# EAGLE design TokTok_Bluetooth (EAGLE 6.4)

## Sheet 1 of 2
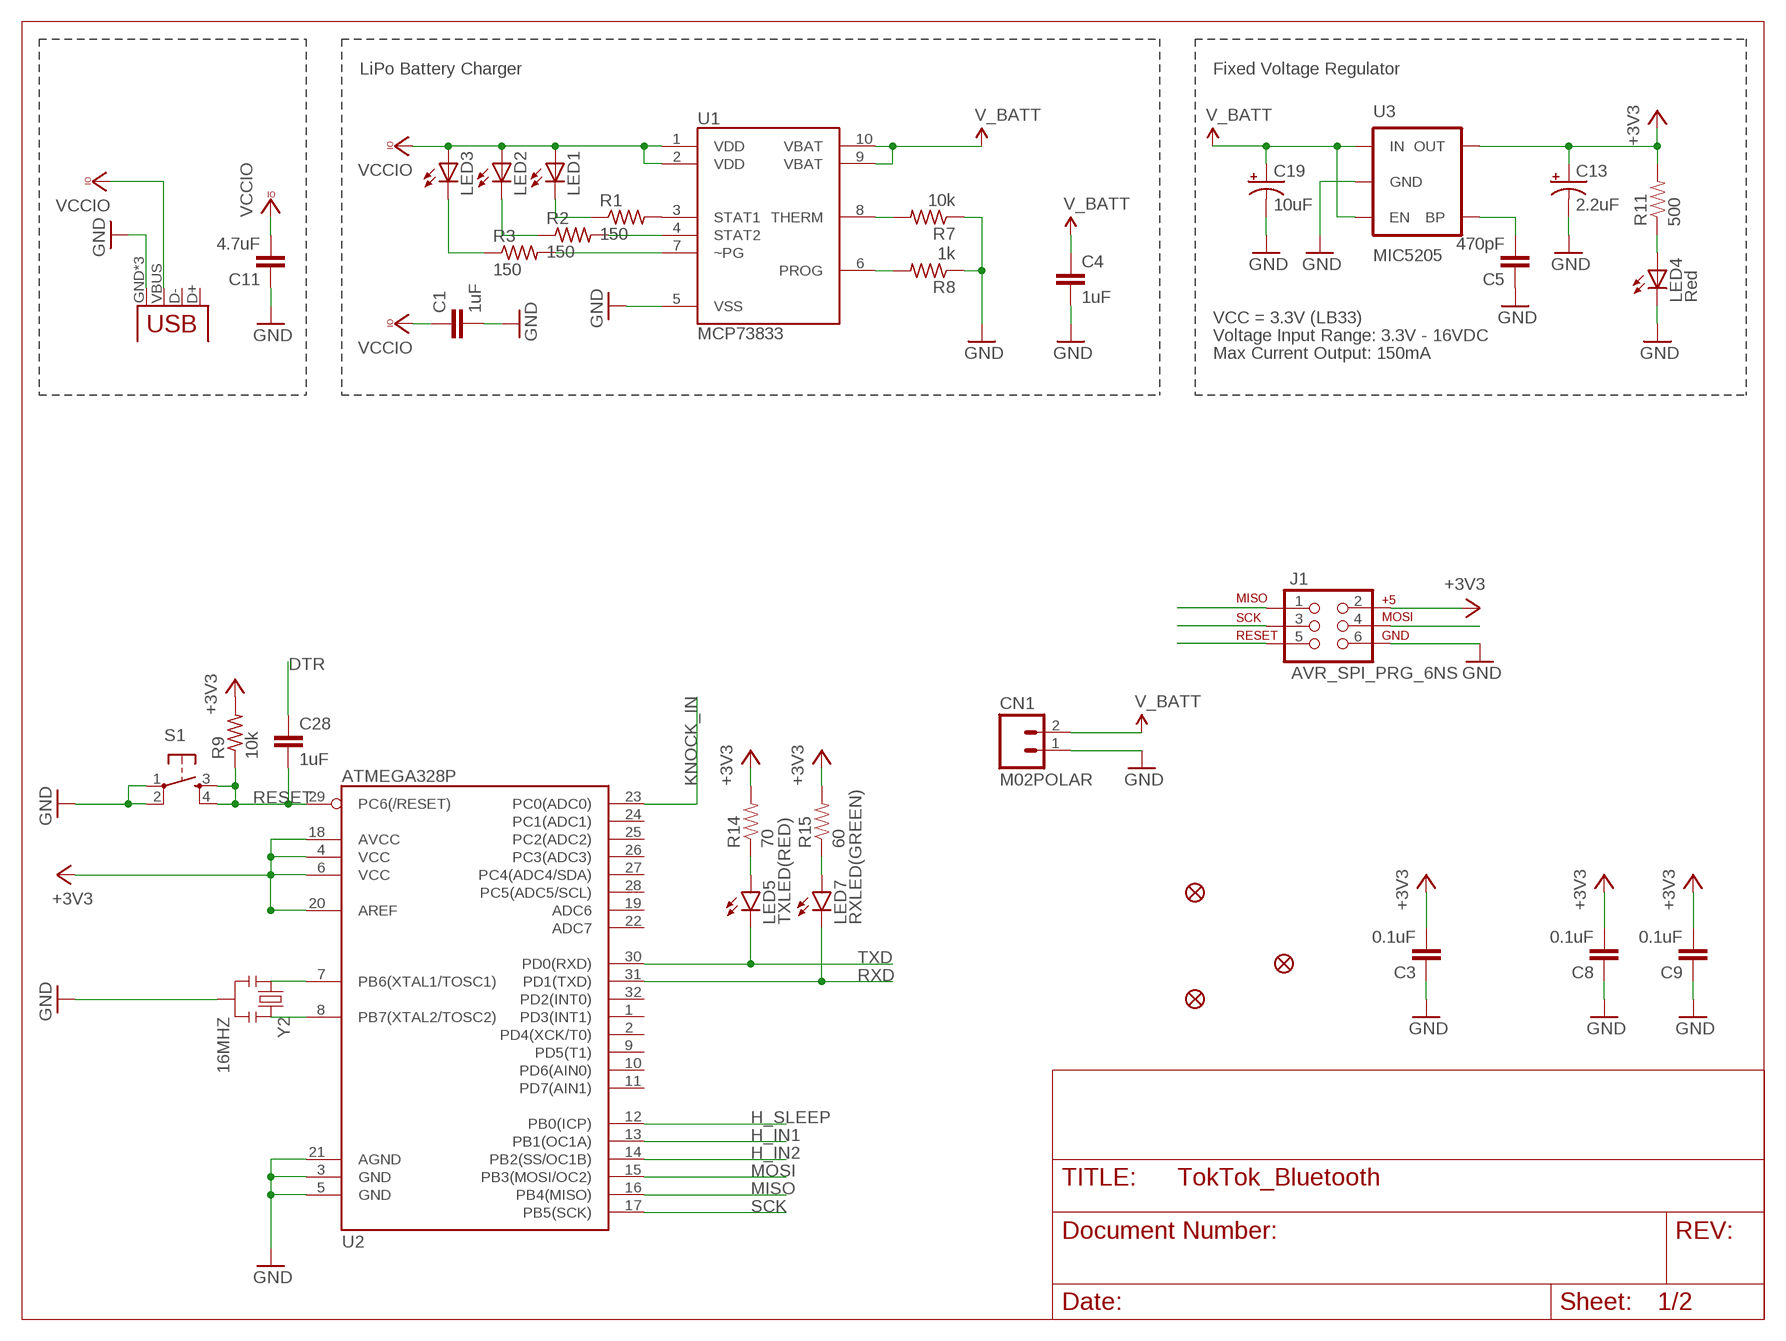
[diagram p0: schematic, sheet 1, part 1 of 2]
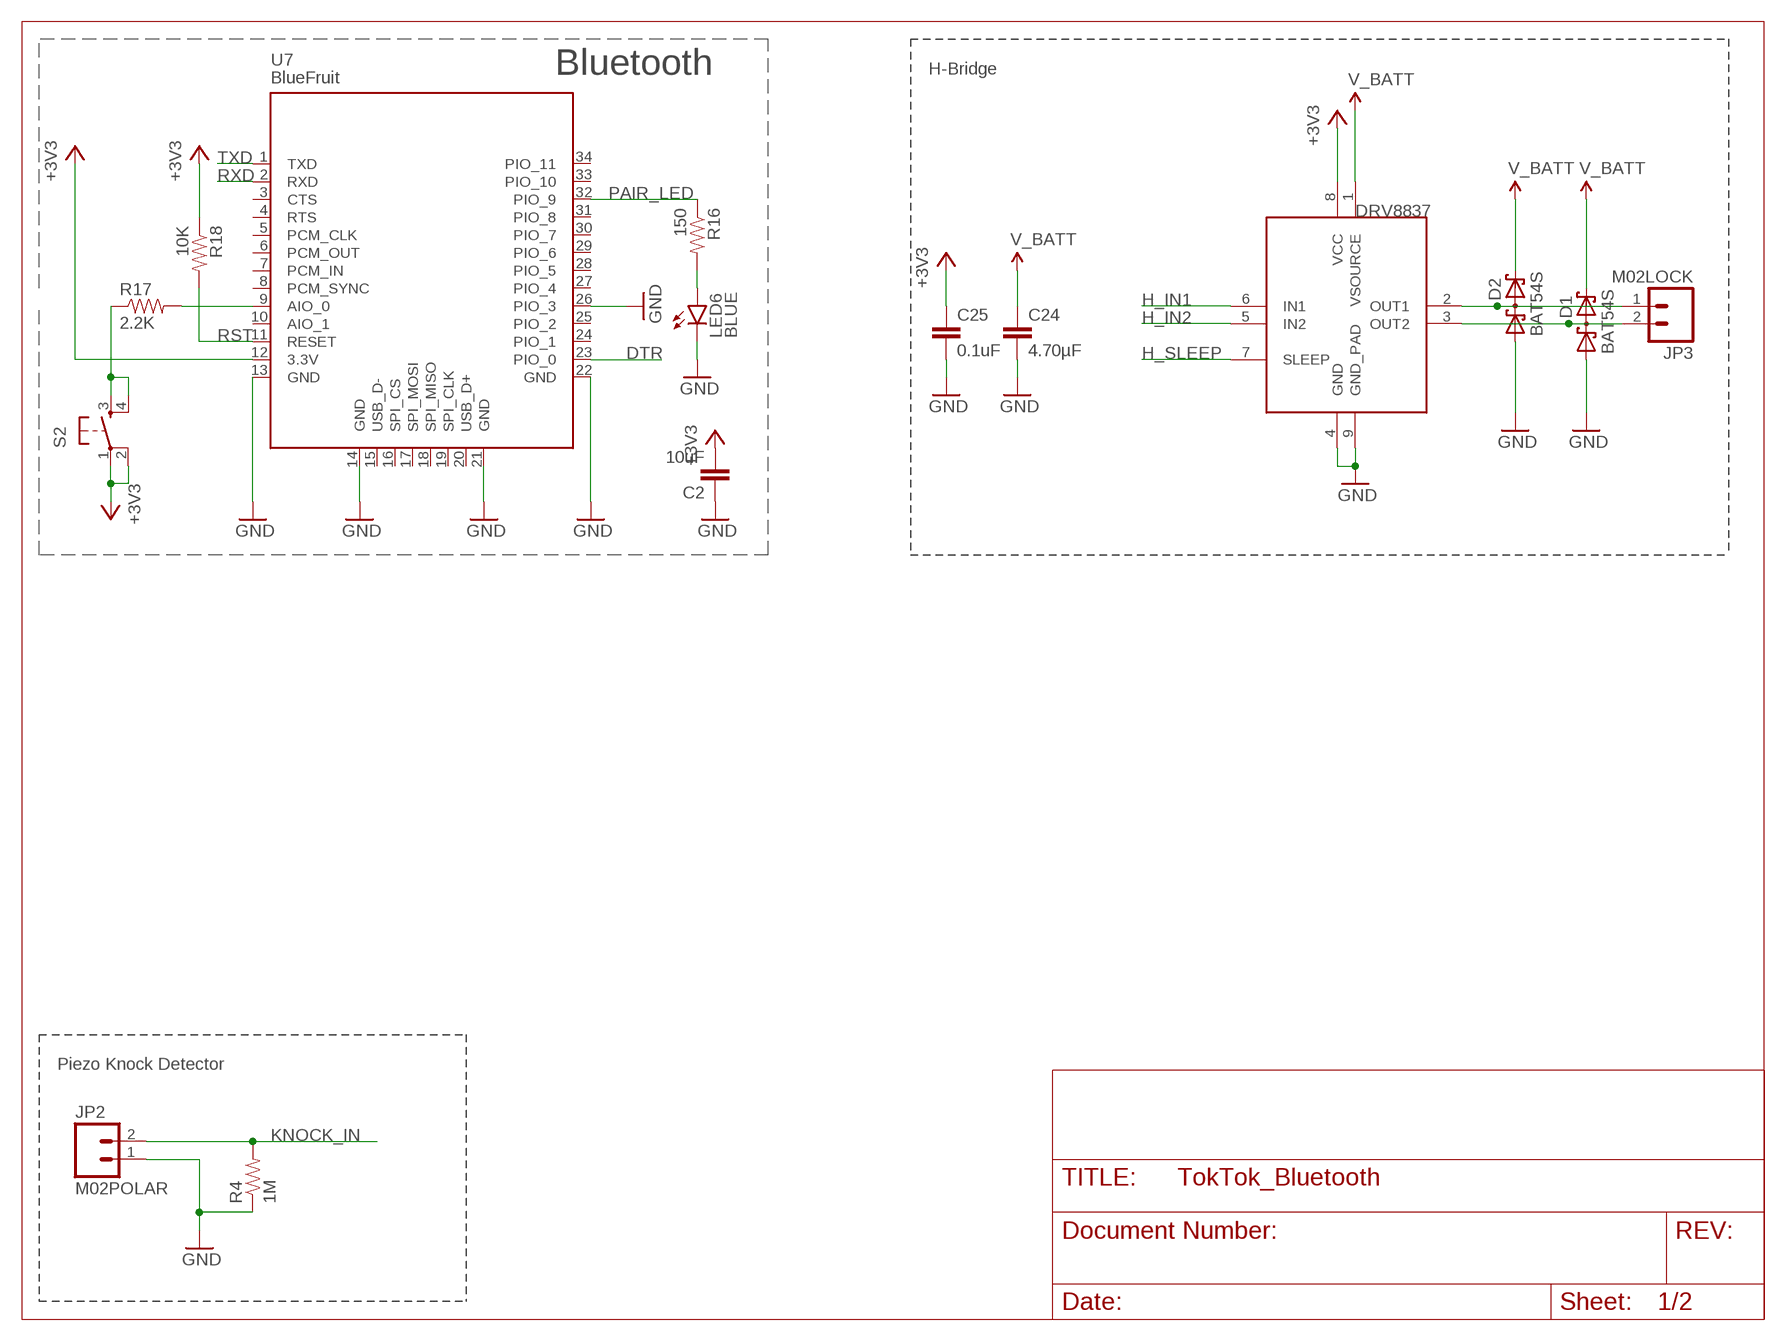
[diagram p1: schematic, sheet 1, part 2 of 2]

### Parts
C1  1uF  C-EUC0805K  [C0805K]
C2  10uF  CAP0805  [0805]
C3  0.1uF  C-EUC0805K  [C0805K]
C4  1uF  C-EUC0805K  [C0805K]
C5  470pF  CAP0805  [0805]
C8  0.1uF  C-EUC0805K  [C0805K]
C9  0.1uF  C-EUC0805K  [C0805K]
C11  4.7uF  C-EUC0805K  [C0805K]
C13  2.2uF  CAP_POL1206  [EIA3216]
C19  10uF  CAP_POL1206  [EIA3216]
C24  4.70µF  CAP0805  [0805]
C25  0.1uF  CAP0805  [0805]
C28  1uF  CAP0805  [0805]
CN1  M02POLAR  [MOLEX-1X2]
D1  BAT54S  [SOT23]
D2  BAT54S  [SOT23]
FID1  FIDUCIAL""  [FIDUCIAL_1MM]
FID2  FIDUCIAL""  [FIDUCIAL_1MM]
FID3  FIDUCIAL""  [FIDUCIAL_1MM]
IC2  DRV8837  [WSON-8]
J1  AVR_SPI_PRG_6NS  [2X3-NS]
JP1  USB-MICROB  [USB-MICROB]
JP2  M02POLAR  [MOLEX-1X2]
JP3  M02LOCK  [1X02_LOCK]
LED1  LEDCHIPLED_1206  [CHIPLED_1206]
LED2  LEDCHIPLED_1206  [CHIPLED_1206]
LED3  LEDCHIPLED_1206  [CHIPLED_1206]
LED4  Red  LED-RED1206  [LED-1206]
LED5  TXLED(RED)  LED1206  [LED-1206]
LED6  BLUE  LED1206  [LED-1206]
LED7  RXLED(GREEN)  LED1206  [LED-1206]
R1  150  R-US_M0805  [M0805]
R2  150  R-US_M0805  [M0805]
R3  150  R-US_M0805  [M0805]
R4  1M  RESISTOR0805-RES  [0805]
R7  10k  R-US_M0805  [M0805]
R8  1k  R-US_M0805  [M0805]
R9  10k  R-US_M0805  [M0805]
R11  500  RESISTOR0805-RES  [0805]
R14  70  RESISTOR0805-RES  [0805]
R15  60  RESISTOR0805-RES  [0805]
R16  150  RESISTOR0805-RES  [0805]
R17  2.2K  RESISTOR0805-RES  [0805]
R18  10K  RESISTOR0805-RES  [0805]
S1  TAC_SWITCHSMD  [TACTILE-SWITCH-SMD]
S2  TAC_SWITCHSMD  [TACTILE-SWITCH-SMD]
U1  MCP73833  [MSOP-10]
U2  ATMEGA328P  ATMEGA328_SMT  [TQFP32-08]
U3  MIC5205  V_REG_LDOSMD  [SOT23-5]
U7  BlueFruit  BLUETOOTH_MODULE  [BLUETOOTH_MODULE]
Y2  16MHZ  RESONATOR8MHZ  [RESONATOR-SMD]

### Nets
+3V3: C2.2 C3.2 C8.2 C9.2 C13.A(+) C25.1 IC2.8(VCC) J1.2 R9.2 R11.2 R14.2 R15.2 R18.1 S2.1 S2.2 U2.4(VCC) U2.6(VCC) U2.18(AVCC) U2.20(AREF) U3.5(OUT) U7.12(3.3V)
DTR: C28.1 U7.23(PIO_0)
GND: C1.2 C2.1 C3.1 C4.2 C5.1 C8.1 C9.1 C11.1 C13.C(-) C19.C(-) C24.2 C25.2 CN1.1 D1.1(A1) D2.1(A1) IC2.4(GND) IC2.9(GND_PAD) J1.6 JP1.GND JP1.MT1(GND) JP1.MT2(GND) JP2.1 LED4.C LED6.C R4.1 R7.1 R8.1 S1.1 S1.2 U1.5(VSS) U2.3(GND) U2.5(GND) U2.21(AGND) U3.2(GND) U7.13(GND) U7.14(GND) U7.21(GND) U7.22(GND) U7.26(PIO_3) Y2.2
H_IN1: IC2.6(IN1) U2.13(PB1(OC1A))
H_IN2: IC2.5(IN2) U2.14(PB2(SS/OC1B))
H_SLEEP: IC2.7(SLEEP) U2.12(PB0(ICP))
KNOCK_IN: JP2.2 R4.2 U2.23(PC0(ADC0))
MISO: J1.1 U2.16(PB4(MISO))
MOSI: J1.4 U2.15(PB3(MOSI/OC2))
N$1: R7.2 U1.8(THERM)
N$2: U2.7(PB6(XTAL1/TOSC1)) Y2.1
N$3: R1.2 U1.3(STAT1)
N$4: R2.2 U1.4(STAT2)
N$5: R3.2 U1.7(~PG)
N$6: LED1.C R1.1
N$7: LED2.C R2.1
N$8: LED3.C R3.1
N$9: U2.8(PB7(XTAL2/TOSC2)) Y2.3
N$10: R8.2 U1.6(PROG)
N$11: R17.1 S2.3 S2.4
N$12: R17.2 U7.9(AIO_0)
N$13: C5.2 U3.4(BP)
N$15: LED5.A R14.1
N$19: LED7.A R15.1
N$20: LED6.A R16.2
N$21: D2.3(C1A2) IC2.2(OUT1) JP3.1
N$23: D1.3(C1A2) IC2.3(OUT2) JP3.2
N$38: LED4.A R11.1
PAIR_LED: R16.1 U7.32(PIO_9)
RESET: C28.2 J1.5 R9.1 S1.3 S1.4 U2.29(PC6(/RESET))
RST: R18.2 U7.11(RESET)
RXD: LED7.C U2.31(PD1(TXD)) U7.2(RXD)
SCK: J1.3 U2.17(PB5(SCK))
TXD: LED5.C U2.30(PD0(RXD)) U7.1(TXD)
V_BATT: C4.1 C19.A(+) C24.1 CN1.2 D1.2(C2) D2.2(C2) IC2.1(VSOURCE) U1.9(VBAT) U1.10(VBAT) U3.1(IN) U3.3(EN)
VCCIO: C1.1 C11.2 JP1.VBUS LED1.A LED2.A LED3.A U1.1(VDD) U1.2(VDD)
Unconnected: JP1.D+ JP1.D- U2.1(PD3(INT1)) U2.2(PD4(XCK/T0)) U2.9(PD5(T1)) U2.10(PD6(AIN0)) U2.11(PD7(AIN1)) U2.19(ADC6) U2.22(ADC7) U2.24(PC1(ADC1)) U2.25(PC2(ADC2)) U2.26(PC3(ADC3)) U2.27(PC4(ADC4/SDA)) U2.28(PC5(ADC5/SCL)) U2.32(PD2(INT0)) U7.3(CTS) U7.4(RTS) U7.5(PCM_CLK) U7.6(PCM_OUT) U7.7(PCM_IN) U7.8(PCM_SYNC) U7.10(AIO_1) U7.15(USB_D-) U7.16(SPI_CS) U7.17(SPI_MOSI) U7.18(SPI_MISO) U7.19(SPI_CLK) U7.20(USB_D+) U7.24(PIO_1) U7.25(PIO_2) U7.27(PIO_4) U7.28(PIO_5) U7.29(PIO_6) U7.30(PIO_7) U7.31(PIO_8) U7.33(PIO_10) U7.34(PIO_11)

### Notes on the sheet
- LiPo Battery Charger | Fixed Voltage Regulator | Bluetooth | H-Bridge
- VCC = 3.3V (LB33)
- Voltage Input Range: 3.3V - 16VDC
- Max Current Output: 150mA
- Piezo Knock Detector

## Sheet 2 of 2

## Library data of the parts
C1 C3 C4 C8 C9 C11 = rcl:C-EU: CAPACITOR, European symbol
C2 C5 C24 C25 C28 = SparkFun-Capacitors:CAP: Capacitor Standard 0603 ceramic capacitor, and 0.1" leaded capacitor.
C13 C19 = SparkFun:CAP_POL: Capacitor Polarized These are standard SMD and PTH capacitors. Normally 10uF, 47uF, and 100uF in electrolytic and tantalum varieties. Always verify the external diameter of the through hole cap, it varies with capacity, voltage, and manufacturer. The EIA devices should be standard.
CN1 JP2 JP3 = SparkFun-Connectors:M02: Standard 2-pin 0.1" header. Use with - straight break away headers ( PRT-00116) - right angle break away headers (PRT-00553) - swiss pins (PRT-00743) - machine pins (PRT-00117) - female headers (PRT-00115) Molex polarized connector foot print use with: PRT-08233 with associated crimp pins and housings. 2.54_SCREWTERM for use with PRT-10571. 3.5mm Screw Terminal footprints for PRT-08084 5mm Screw Terminal footprints for use with PRT-08433
D1 D2 = diode:BAT54S: Schottky Diodes Pin connection corrected 2011-05-04 Source: Fairchild .. BAT54.pdf
FID1-FID3 = microbuilder:FIDUCIAL: Fiducial Alignment Points Various fiducial points for machine vision alignment.; BOM: EXCLUDE
IC2 = digikey:DRV8837: DRV8837 DSG - H-Bridge
J1 = SparkFun-Connectors:AVR_SPI_PRG_6: AVR ISP 6 Pin This is the reduced ISP connector for AVR programming. Common on Arduino. This footprint will take up less PCB space and can be used with a 10-pin to 6-pin adapter such as SKU: BOB-08508
JP1 = SparkFun-Connectors:USB: USB Connectors USB-B-PTH is fully proven SKU : PRT-00139/CONN-08278 USB-miniB is fully proven SKU : PRT-00587 USB-A-PCB is untested. USB-A-H is throughly reviewed, but untested. Spark Fun Electronics SKU : PRT-00437 USB-B-SMT is throughly reviewed, but untested. Needs silkscreen touching up. USB-A-S has not been used/tested USB-MB-H has not been used/tested USB-MICROB has been used. CONN-09505; PROD_ID: CONN-09505
LED1-LED3 = adafruit:LED: LED OSRAM: - CHIPLED LG R971, LG N971, LY N971, LG Q971, LY Q971, LO R971, LY R971 LH N974, LH R974 LS Q976, LO Q976, LY Q976 LO Q996 - Hyper CHIPLED LW Q18S LB Q993, LB Q99A, LB R99A - SideLED LS A670, LO A670, LY A670, LG A670, LP A670 LB A673, LV A673, LT A673, LW A673 LH A674 LY A675 LS A676, LA A676, LO A676, LY A676, LW A676 LS A679, LY A679, LG A679 - Hyper Micro SIDELED® LS Y876, LA Y876, LO Y876, LY Y876 LT Y87S - SmartLED LW L88C, LW L88S LB L89C, LB L89S, LG L890 LS L89K, LO L89K, LY L89K LS L896, LA L896, LO L896, LY L896 - TOPLED LS T670, LO T670, LY T670, LG T670, LP T670 LSG T670, LSP T670, LSY T670, LOP T670, LYG T670 LG T671, LOG T671, LSG T671 LB T673, LV T673, LT T673, LW T673 LH T674 LS T676, LA T676, LO T676, LY T676, LB T676, LH T676, LSB T676, LW T676 LB T67C, LV T67C, LT T67C, LS T67K, LO T67K, LY T67K, LW E67C LS E67B, LA E67B, LO E67B, LY E67B, LB E67C, LV E67C, LT E67C LW T67C LS T679, LY T679, LG T679 LS T770, LO T770, LY T770, LG T770, LP T770 LB T773, LV T773, LT T773, LW T773 LH T774 LS E675, LA E675, LY E675, LS T675 LS T776, LA T776, LO T776, LY T776, LB T776 LHGB T686 LT T68C, LB T68C - Hyper Mini TOPLED® LB M676 - Mini TOPLED Santana® LG M470 LS M47K, LO M47K, LY M47K Source: http://www.osram.convergy.de/
LED4 = SparkFun-LED:LED-RED: Assorted Red LEDs LilyPad 1206- DIO-09912 1206- DIO-00809 0603- DIO-00819; PROD_ID: DIO-00809; VALUE: RED
LED5-LED7 = SparkFun-LED:LED: LEDs Standard schematic elements and footprints for 5mm, 3mm, 1206, and 0603 sized LEDs. 5mm - Spark Fun Electronics SKU : COM-00529 (and others)
R1-R3 R7-R9 = resistor:R-US_: RESISTOR, American symbol
R4 R11 R14-R18 = SparkFun-Resistors:RESISTOR: Resistor Basic schematic elements and footprints for 0603, 1206, and PTH resistors.
S1 S2 = SparkFun-Electromechanical:TAC_SWITCH: Momentary Switch Button commonly used for reset or general input. Spark Fun Electronics SKU : COM-00097 SMT- SWCH-08247
U1 = SparkFun-PowerIC:MCP73833: Stand-alone Linear Li-ion/Li-polymer Charge Management Controller Packages: DFN-10, MSOP-10 Last modified: 8/17/10 Unproven!
U2 = SparkFun-DigitalIC:ATMEGA328_SMT: 32-Pin Atmega328 part Commonly used on Arduino compatible boards Available in QFP and QFN packages TQFP is IC-09069 QFN is non-stock; PROD_ID: IC-09069
U3 = SparkFun:V_REG_LDO: Voltage Regulator LDO Standard 150mA LDO voltage regulator in SOT-23 layout. Micrel part MIC5205. BP (by-pass) pin is used to lower output noise with 470pF cap.
U7 = microbuilder:BLUETOOTH_MODULE: BLUETOOTH MODULE
Y2 = SparkFun-FreqCtrl:RESONATOR: Resonator Small SMD resonator. Used, eg, on the Arduino Pro/ Pro Mini boards. 8MHz- XTAL-08895 16MHz- XTAL-08900; PROD_ID: XTAL-08895; VALUE: 8MHZ

## Net classes
1 vcc: width 0.254 mm

## Board
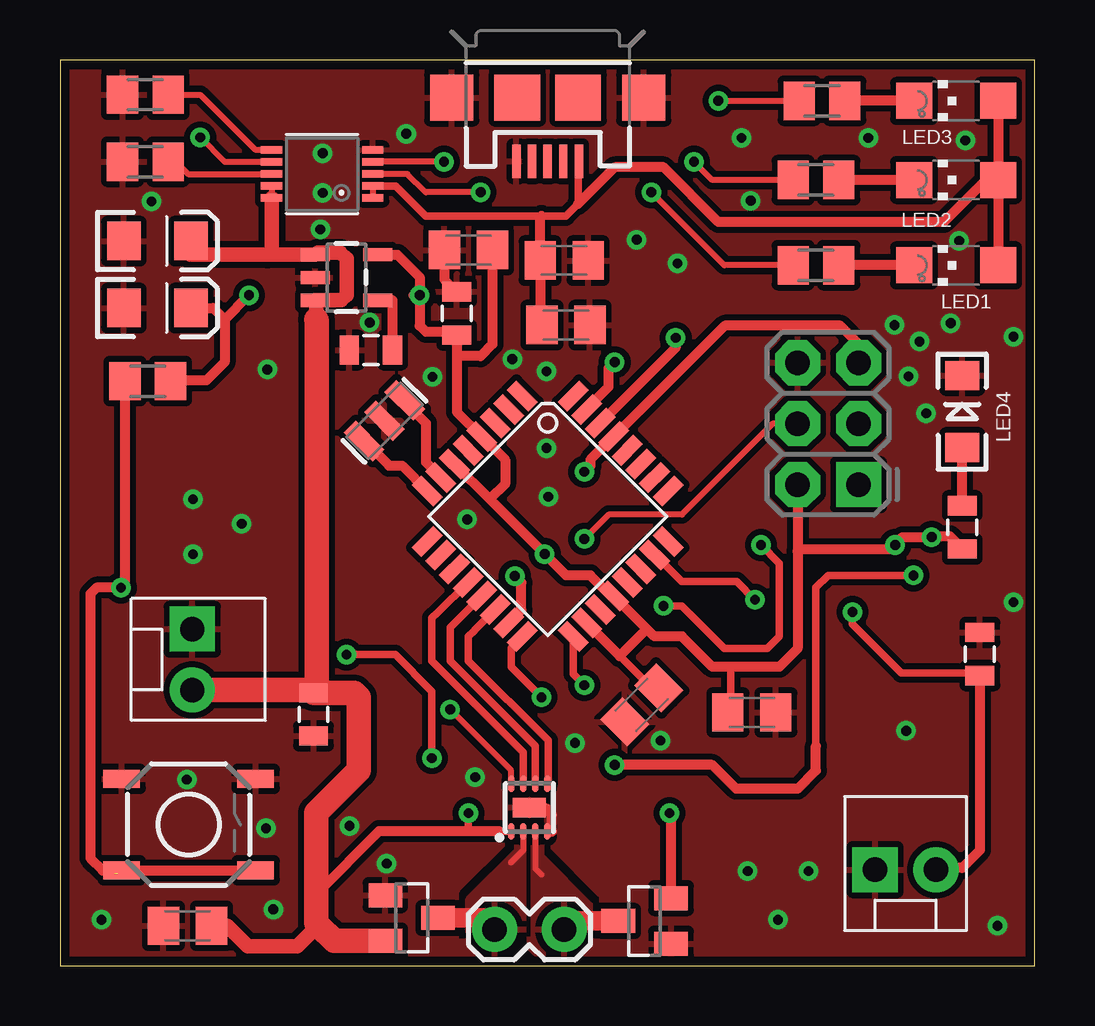
[diagram p2: board, top side]
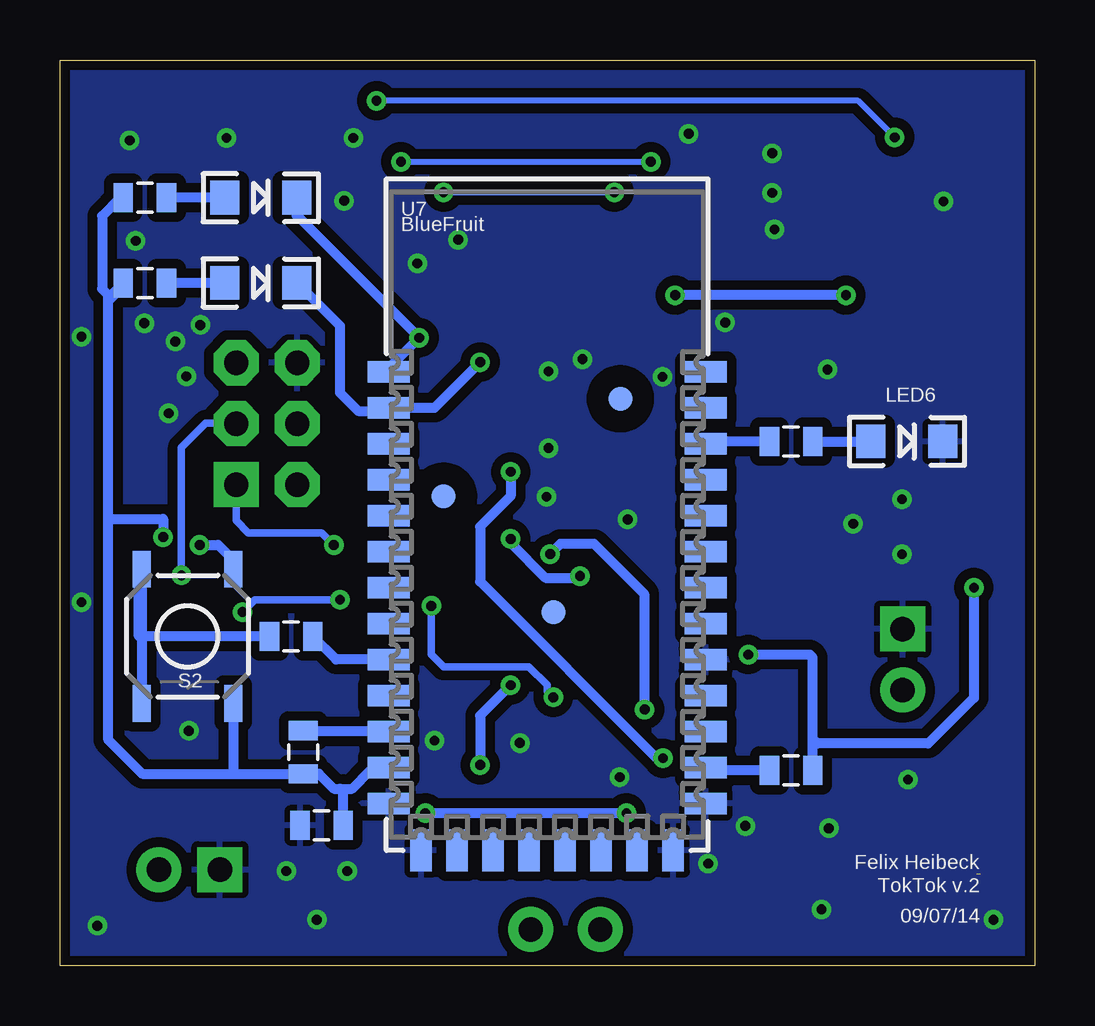
[diagram p3: board, bottom side, seen from below]

Size 40.62 x 37.77 mm. Coordinates in mm from the lower left corner, seen from the top.
Outline: 0,0 40.62,0 40.62,37.77 0,37.77 0,0
Copper layers (1*16): Top 0.035mm / dielectric 15mil / Bottom 0.035mm
Design rules "default *": minimum track width 8mil, minimum drill 13mil, track to track 7mil, track to pad 7mil, pad to pad 7mil, via to via 7mil, smd to smd 6mil, copper to edge 15mil, drill to drill 8mil, minimum pad ring 10mil, minimum via ring 8mil, stop-mask expansion 4mil, vias tented up to drill 0mil, thermal gap 10mil

### Footprints (pad centres in the part's own frame; a part is rotated, then mirrored left to right if it is on the bottom)
C0805K = smd 1.3 x 1.6: 1 -1,0; 2 1,0
0805 = smd 0.8 x 1.2: 1 -0.9,0; 2 0.9,0
EIA3216 = smd 1.4 x 1.6: A 1.4,0; C -1.4,0
MOLEX-1X2 = drill 1.016 pad 1.88 square: 1 0,0 | drill 1.016 pad 1.88: 2 2.54,0
SOT23 = smd 1 x 1.4: 1 -0.95,-1.1; 2 0.95,-1.1; 3 0,1.1
FIDUCIAL_1MM = smd 1 x 1: 1 0,0
WSON-8 = smd 0.7 x 0.279: 1 -0.99,0.75; 2 -0.99,0.25; 3 -0.99,-0.25; 4 -0.99,-0.75; 5 0.99,-0.75; 6 0.99,-0.25; 7 0.99,0.25; 8 0.99,0.75 | smd 0.8 x 1.38: 9 0,0
2X3-NS = drill 1.016 pad 1.88 square: 1 -2.54,-1.27 | drill 1.016 pad 1.88 octagon: 2 -2.54,1.27; 3 0,-1.27; 4 0,1.27; 5 2.54,-1.27; 6 2.54,1.27
USB-MICROB = smd 0.35 x 1.4: D+ 0,2.65; D- -0.65,2.65; GND 1.3,2.65; ID 0.65,2.65; VBUS -1.3,2.65 | smd 1.8 x 1.9: MT1 -4,0; MT2 4,0 | smd 1.9 x 1.9: P$1 -1.27,0; P$2 1.27,0
1X02_LOCK = drill 1.016 pad 1.88: 1 -0.178,0; 2 2.718,0
CHIPLED_1206 = smd 1.5 x 1.5: A 0,-1.75; C 0,1.75
LED-1206 = smd 1.2 x 1.4: A -1.5,0; C 1.5,0
M0805 = smd 1.3 x 1.6: 1 -0.95,0; 2 0.95,0
TACTILE-SWITCH-SMD = smd 1.524 x 0.762: 1 -2.794,1.905; 2 2.794,1.905; 3 -2.794,-1.905; 4 2.794,-1.905
MSOP-10 = smd 0.305 x 0.889: 1 -1,-2.11; 2 -0.5,-2.11; 3 0,-2.11; 4 0.5,-2.11; 5 1,-2.11; 6 1,2.11; 7 0.5,2.11; 8 0,2.11; 9 -0.5,2.11; 10 -1,2.11
TQFP32-08 = smd 1.27 x 0.559: 1 -4.293,2.8; 2 -4.293,2; 3 -4.293,1.2; 4 -4.293,0.4; 5 -4.293,-0.4; 6 -4.293,-1.2; 7 -4.293,-2; 8 -4.293,-2.8; 17 4.293,-2.8; 18 4.293,-2; 19 4.293,-1.2; 20 4.293,-0.4; 21 4.293,0.4; 22 4.293,1.2; 23 4.293,2; 24 4.293,2.8 | smd 0.559 x 1.27: 9 -2.8,-4.293; 10 -2,-4.293; 11 -1.2,-4.293; 12 -0.4,-4.293; 13 0.4,-4.293; 14 1.2,-4.293; 15 2,-4.293; 16 2.8,-4.293; 25 2.8,4.293; 26 2,4.293; 27 1.2,4.293; 28 0.4,4.293; 29 -0.4,4.293; 30 -1.2,4.293; 31 -2,4.293; 32 -2.8,4.293
SOT23-5 = smd 0.55 x 1.2: 1 -0.95,-1.3; 2 0,-1.3; 3 0.95,-1.3; 4 0.95,1.3; 5 -0.95,1.3
BLUETOOTH_MODULE = smd 1.75 x 0.9: 1 -6.6,5.95; 2 -6.6,4.45; 3 -6.6,2.95; 4 -6.6,1.45; 5 -6.6,-0.05; 6 -6.6,-1.55; 7 -6.6,-3.05; 8 -6.6,-4.55; 9 -6.6,-6.05; 10 -6.6,-7.55; 11 -6.6,-9.05; 12 -6.6,-10.55; 13 -6.6,-12.05; 22 6.6,-12.05; 23 6.6,-10.55; 24 6.6,-9.05; 25 6.6,-7.55; 26 6.6,-6.05; 27 6.6,-4.55; 28 6.6,-3.05; 29 6.6,-1.55; 30 6.6,-0.05; 31 6.6,1.45; 32 6.6,2.95; 33 6.6,4.45; 34 6.6,5.95 | smd 0.9 x 1.75: 14 -5.25,-14; 15 -3.75,-14; 16 -2.25,-14; 17 -0.75,-14; 18 0.75,-14; 19 2.25,-14; 20 3.75,-14; 21 5.25,-14
RESONATOR-SMD = smd 0.7 x 1.7: 1 -1.2,0; 2 0,0; 3 1.2,0

### Placement (x,y rotation side)
C1  21.01,29.41 0 top
C2  29.72,5.87 0 bottom
C3  17.02,29.85 0 top
C4  5.31,1.68 180 top
C5  12.95,25.68 0 top
C8  28.83,10.57 180 top
C9  24.24,10.88 45 top
C11  21.08,26.72 180 top
C13  4.06,27.43 0 top
C19  4.06,30.23 0 top
C24  10.57,10.49 270 top
C25  16.54,27.2 90 top
C28  10.16,8.15 0 bottom
CN1  5.51,14.05 270 top
D1  24.36,1.88 90 top
D2  14.66,2.01 270 top
FID1  17.27,23.65 0 bottom
FID2  24.64,19.58 0 bottom
FID3  20.07,14.76 0 bottom
IC2  19.56,6.6 90 top
J1  32,22.61 90 top
JP1  20.32,36.2 180 top
JP2  33.96,4.01 0 top
JP3  18.29,1.52 0 top
LED1  37.34,29.21 90 top
LED2  37.34,32.77 90 top
LED3  37.34,36.07 90 top
LED4  37.59,23.11 90 top
LED5  32.26,32.03 0 bottom
LED6  5.33,21.87 0 bottom
LED7  32.26,28.47 0 bottom
R1  31.5,29.21 180 top
R2  31.5,32.77 180 top
R3  31.75,36.07 180 top
R4  38.33,13 270 top
R7  3.56,33.53 0 top
R8  3.56,36.32 0 top
R9  3.66,24.38 0 top
R11  37.59,18.29 270 top
R14  37.08,32.03 180 bottom
R15  37.08,28.47 180 bottom
R16  10.16,21.87 0 bottom
R17  30.99,13.74 0 bottom
R18  30.48,8.92 90 bottom
S1  5.36,5.89 0 top
S2  35.31,13.74 270 bottom
U1  10.92,33.02 90 top
U2  20.32,18.75 315 top
U3  11.94,28.7 270 top
U7  20.32,18.82 0 bottom
Y2  13.52,22.73 225 top

### Tracks (layer width: path | path; a pad name or v marks a point on that pad's centre or on a via)
+3V3  (via drill 0.41)
  Top 0.254: IC2.8 18.8,7.59 18.8,8.15 v16.26,10.69
  Top 0.305: 25.41,11.12 C9.2 24.65,11.59 23.31,12.93 | 27.94,12.47 27.94,10.68 C8.2
  Top 0.406: U3.5 14.06,29.65 14.99,28.73 v14.99,27.97 | U2.18 23.31,12.93 24.45,14.06 | 17.91,19.46 v20.2,17.17 21.09,16.28 22.1,16.28 22.95,15.43 U2.20 24.45,14.06 | 17.91,19.46 U2.6 | 17.91,19.46 18.54,20.09 18.54,21.11 17.58,22.07 U2.4 16.54,23.1 16.54,25.43 | 24.45,14.06 24.76,13.74 25.91,13.74 27.18,12.47 27.94,12.47 29.97,12.47 30.73,13.23 30.73,17.3 | J1.2 30.73,17.3 | C13.A 6.38,27.43 6.86,26.95 | 6.86,26.95 6.86,25.17 6.1,24.41 4.63,24.41 R9.2 | 30.73,17.3 30.82,17.39 34.63,17.39 v34.8,17.55 34.8,17.58 35.1,17.88 v36.32,17.88 36.35,17.91 37.08,17.91 37.44,17.55 37.59,17.55 R11.2 | 6.86,26.95 v7.87,27.97 | v14.99,27.97 14.73,27.97 | v14.99,27.97 14.99,26.7 15.24,26.44 16.4,26.44 C25.1 16.54,25.43 | C3.2 18.02,25.92 17.53,25.43 16.54,25.43
  Bottom 0.406: v7.87,27.97 v14.99,27.97 | R14.2 38.1,32.03 38.86,31.27 38.86,28.22 38.61,27.97 38.61,27.85 | 38.61,18.64 38.61,9.42 37.2,8.02 33.53,8.02 | 38.61,18.64 38.61,27.71 | 38.61,27.71 38.61,27.85 | 38.61,27.85 R15.2 37.98,28.34 38.61,27.71 | 33.53,8.02 R18.1 29.83,8.02 29.21,7.39 28.96,7.39 | 28.96,7.39 28.45,7.39 27.69,8.15 27.04,8.15 U7.12 | v34.8,17.55 34.04,17.55 33.53,17.04 33.53,16.66 S2.1 | C2.2 28.82,7.25 28.96,7.39 | S2.2 33.4,8.14 33.53,8.02 | 38.61,18.64 36.32,18.64 v36.32,17.88 | v20.2,17.17 19.77,17.6 18.36,17.6 16.28,15.52 16.28,10.72 v16.26,10.69
DTR
  Bottom 0.406: C28.1 13.6,8.15 U7.23
GND  (via drill 0.41)
  Top 0.254: IC2.4 20.5,5.61
  Top 0.406: C3.1 16.02,28.62 C25.2 | 20.5,5.61 20.5,6.3 20.19,6.6 IC2.9
  other vias: 3.81,31.88 37.47,30.23 37.72,34.42 35.81,26.04 10.95,32.23 36.09,23.04 28.78,31.9 28.4,34.52 33.68,34.52 39.73,26.24 25.73,29.29 14.43,34.7 10.95,33.88 10.85,30.71 12.06,5.84 8.89,2.36 5.28,7.77 8.59,5.74 35.26,9.8 21.46,9.3 5.54,17.17 5.54,19.46 7.57,18.44 31.19,3.96 28.65,3.96 29.92,1.93 16.97,18.62 20.27,21.59 20.27,24.79 12.9,26.82 39.07,1.68 1.73,1.93 18.85,25.3 15.52,24.56 17.3,7.87 13.61,4.27 25.02,9.4 35.36,24.59 37.11,26.8 34.77,26.72 39.73,15.16 20.35,19.56 24.03,30.28 8.64,24.87
  pour Top (isolate 0.254, rank 6): -0.13,38.1 41.15,38.1 41.15,-0.25 -0.25,-0.25 -0.25,37.97 -0.13,37.97
  pour Bottom (isolate 0.406): -0.25,37.97 41.15,37.97 41.15,-0.38 -0.64,-1.02 -0.25,37.85
H_IN1
  Top 0.305: 17.57,15.31 U2.13 16.26,14.12 16.26,12.73 19.81,9.17 IC2.6
H_IN2
  Top 0.254: 20.33,7.62 IC2.5
  Top 0.305: 20.33,7.62 20.33,9.41 17.02,12.73 17.02,13.74 17.27,14 U2.14
H_SLEEP
  Top 0.305: IC2.7 19.31,8.91 15.49,12.73 15.49,14.5 15.73,14.74 15.75,14.74 U2.12
KNOCK_IN  (via drill 0.41)
  Top 0.305: U2.23 24.81,17.13 25.91,16.03 28.19,16.03 v28.96,15.27 | v33.02,14.76 33.02,14.25 35.05,12.22 38.22,12.22 R4.2
  Top 0.406: R4.2 38.33,4.83 37.59,4.09 36.58,4.09 JP2.2
  Bottom 0.305: v28.96,15.27 32.51,15.27 v33.02,14.76
MISO  (via drill 0.41)
  Top 0.305: 19.27,13.7 U2.16 18.8,13.26 18.8,12.47 v20.07,11.2 | v25.15,15.01 25.91,15.01 27.69,13.23 29.46,13.23 29.97,13.74 29.97,16.79 v29.21,17.55
  Bottom 0.305: v29.21,17.55 29.72,18.06 32.77,18.06 33.27,18.57 J1.1 | v25.15,15.01 25.15,12.98 24.64,12.47 21.08,12.47 20.32,11.71 20.32,11.46 v20.07,11.2
MOSI  (via drill 0.41)
  Top 0.254: J1.4 29.69,22.61 25.91,18.82 22.86,18.82 v21.84,17.81
  Top 0.406: U2.15 18.7,14.31 19.23,14.83 19.23,15.98 v18.95,16.26
  Bottom 0.406: v21.84,17.81 21.84,17.63 20.4,16.18 19.02,16.18 v18.95,16.26
N$1
  Top 0.254: R7.2 4.83,33.53 5.33,33.02 U1.8
N$2
  Top 0.406: Y2.1 14.37,23.5 15.24,22.63 15.24,21 U2.7
N$3  (via drill 0.41)
  Top 0.254: R1.2 27.69,29.21 v24.64,32.26 | v17.53,32.26 15.24,32.26 14.48,33.02 U1.3
  Bottom 0.254: v24.64,32.26 v17.53,32.26
N$4  (via drill 0.41)
  Top 0.254: R2.2 27.18,32.77 v26.42,33.53 | v16,33.53 13.04,33.53 U1.4
  Bottom 0.254: v26.42,33.53 v16,33.53
N$5  (via drill 0.41, 0.41 pad 0.25)
  Top 0.254: U1.7 6.87,33.52 v5.84,34.54 | v27.43,36.07 R3.2
  Bottom 0.254: v5.84,34.54 7.37,36.07 v27.43,36.07
N$6
  Top 0.406: LED1.C R1.1
N$7
  Top 0.406: LED2.C R2.1
N$8
  Top 0.406: LED3.C R3.1
N$9
  Top 0.406: Y2.3 12.69,21.88 13.72,20.85 14.26,20.85 U2.8
N$10
  Top 0.254: R8.2 5.84,36.32 8.13,34.04 8.8,34.04 U1.6
N$11
  Bottom 0.406: R17.1 37.34,13.74 37.34,16.41 S2.3 S2.4
N$12
  Bottom 0.406: U7.9 29.12,12.77 R17.2
N$13
  Top 0.406: U3.4 13.85,27.75 C5.2
N$15
  Bottom 0.406: LED5.A R14.1
N$19
  Bottom 0.406: LED7.A R15.1
N$20
  Bottom 0.406: R16.2 LED6.A
N$21
  Top 0.254: IC2.2 19.31,4.83 18.8,4.32
  Top 0.813: D2.3 17.63,2.01 JP3.1
  pour Top (rank 2): 19.3,5.59 19.3,0.76 18.8,0.25 17.53,0.25 17.02,0.76 17.02,2.79 19.05,4.83 19.05,5.59
N$23
  Top 0.254: IC2.3 19.81,4.07 20.07,3.81
  Top 0.813: D1.3 21.36,1.88 JP3.2
  pour Top (rank 3): 19.56,5.59 19.56,0.76 20.07,0.25 21.59,0.25 22.1,0.76 22.1,2.54 20.07,4.57 20.07,5.33 19.81,5.59
N$38
  Top 0.406: R11.1 LED4.A
PAIR_LED
  Bottom 0.406: R16.1 13.62,21.87 U7.32
RESET  (via drill 0.41)  (1 unrouted)
  Top 0.305: v11.94,12.98 13.97,12.98 15.49,11.46 v15.49,8.66
  Top 0.406: 2.29,3.84 2.67,3.84 | S1.3 S1.4 | J1.5 33.27,25.93 32.51,26.7 27.7,26.7 U2.29 23.06,22.07 22.1,21.11 22.1,20.85 v21.84,20.6 | R9.1 2.71,15.94 v2.54,15.77 1.52,15.77 1.27,15.52 1.27,4.5 1.78,3.99 S1.3 | 2.41,3.84 S1.3
  Bottom 0.406: v15.49,8.66 15.75,8.66 23.11,16.03 23.11,18.31 21.84,19.58 v21.84,20.6 | C28.2 9.26,9.47 | 9.26,9.47 9.26,12.86 9.38,12.98 v11.94,12.98 | 9.26,9.47 9.06,9.27 4.45,9.27 2.54,11.18 v2.54,15.77
RST
  Bottom 0.406: U7.11 30.44,9.77 R18.2
RXD  (via drill 0.41)
  Top 0.406: U2.31 21.94,23.24 22.86,24.16 22.86,24.92 v23.11,25.17
  Bottom 0.406: LED7.C 30.73,28.47 28.96,26.7 28.96,23.9 28.19,23.14 27.05,23.14 U7.2 25.01,23.27 v23.11,25.17
SCK  (via drill 0.41)
  Top 0.305: U2.17 21.38,12.18 v21.84,11.71 | 31.5,9.17 31.5,15.77 32,16.28 v35.56,16.28
  Top 0.406: 31.5,9.17 31.5,8.15 30.73,7.39 28.17,7.39 27.18,8.38 v23.11,8.38
  Bottom 0.305: v35.56,16.28 35.56,21.62 34.54,22.63 33.3,22.63 J1.3
  Bottom 0.406: v21.84,11.71 23.11,10.44 v23.11,8.38
TXD  (via drill 0.41)
  Top 0.406: v25.65,26.19 25.65,25.78 U2.30
  Bottom 0.406: U7.1 26.92,24.92 v25.65,26.19 30.76,31.29 LED5.C
V_BATT  (via drill 0.41)
  Top 0.254: U1.9 U1.10
  Top 0.305: 18.29,5.61 IC2.1 | v17.02,6.38 17.02,5.61
  Top 0.406: 10.67,5.61 | 18.29,5.61 17.02,5.61 13.29,5.61 10.67,3 | D1.2 25.46,6.32 v25.4,6.38
  Top 0.61: 10.67,26.95 10.67,27.72 U3.3 11.72,27.75 11.94,27.97 11.94,29.49 11.68,29.74 10.73,29.74 U3.1 8.64,29.65 | 8.64,29.65 5.42,29.65 5.33,29.74 5.33,30.1 C19.A | U1.10 8.81,29.83 8.64,29.65 | C4.1 6.96,1.68 7.82,0.81 9.88,0.81 10.77,1.7
  Top 1.016: CN1.2 10.7,11.51 | 10.7,11.51 C24.1 12.26,11.39 12.45,11.2 12.45,8.15 10.67,6.38 10.67,5.61 10.67,3 10.67,1.8 10.77,1.7 11.43,1.04 13.54,1.04 D2.2 | 10.7,11.51 10.7,26.91 10.67,26.95
  Bottom 0.406: v25.4,6.38 v17.02,6.38
VCCIO
  Top 0.254: U1.2 U1.1
  Top 0.305: U1.2 13.99,32.52 15.24,31.27 20.07,31.27 21.08,31.27 21.59,31.78 21.59,33.52 JP1.VBUS
  Top 0.406: LED3.A LED2.A | LED2.A LED1.A | 20.07,31.27 20.01,31.21 C1.1 20.01,26.8 C11.2 | LED2.A 38.58,32.77 36.83,31.01 27.43,31.01 25.15,33.3 23.11,33.3 21.59,31.78

### Text on the board
bNames: Felix Heibeck | TokTok v.2 | 09/07/14